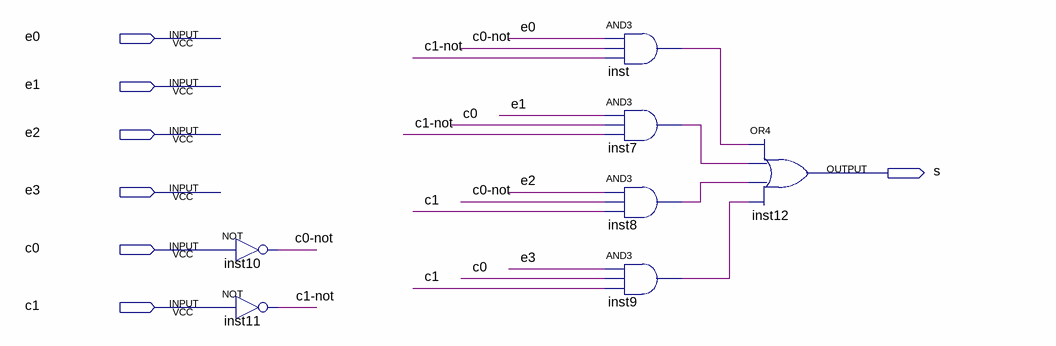
[diagram p0: schematic sheet]
// Quartus schematic Pratica02_mux_4x1_1bit.bdf as structural Verilog: 7 symbols, 7 pins
module Pratica02_mux_4x1_1bit (
  input  e0,
  input  e1,
  input  e2,
  input  e3,
  input  c0,
  input  c1,
  output s
);

  wire \c0-not , \c1-not , inst7_out, inst8_out, inst9_out, inst_out;

  not inst10 (\c0-not , c0);
  not inst11 (\c1-not , c1);
  and inst (inst_out, e0, \c0-not , \c1-not );
  and inst7 (inst7_out, e1, c0, \c1-not );
  and inst8 (inst8_out, e2, \c0-not , c1);
  and inst9 (inst9_out, e3, c0, c1);
  or inst12 (s, inst_out, inst7_out, inst8_out, inst9_out);
endmodule
